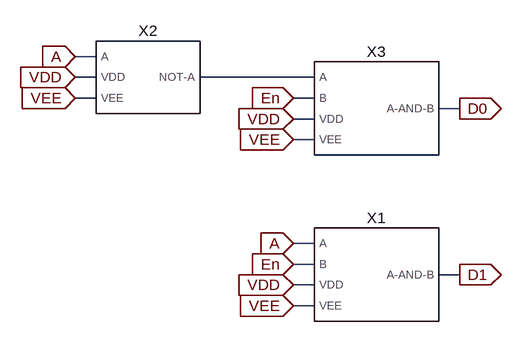
[diagram p0: schematic 1_to_2_Decoder_Symbol.asc]
1_to_2_Decoder_Symbol.asc, the LTspice schematic file:
Version 4
SHEET 1 880 680
WIRE 176 -48 144 -48
WIRE 176 -16 144 -16
WIRE 512 -16 336 -16
WIRE 176 16 144 16
WIRE 512 16 480 16
WIRE 736 32 704 32
WIRE 512 48 480 48
WIRE 512 80 480 80
WIRE 512 240 480 240
WIRE 512 272 480 272
WIRE 736 288 704 288
WIRE 512 304 480 304
WIRE 512 336 480 336
FLAG 144 -16 VDD
IOPIN 144 -16 In
FLAG 480 48 VDD
IOPIN 480 48 In
FLAG 480 304 VDD
IOPIN 480 304 In
FLAG 480 16 En
IOPIN 480 16 In
FLAG 480 80 VEE
IOPIN 480 80 In
FLAG 480 336 VEE
IOPIN 480 336 In
FLAG 480 272 En
IOPIN 480 272 In
FLAG 144 16 VEE
IOPIN 144 16 In
FLAG 144 -48 A
IOPIN 144 -48 In
FLAG 480 240 A
IOPIN 480 240 In
FLAG 736 32 D0
IOPIN 736 32 Out
FLAG 736 288 D1
IOPIN 736 288 Out
SYMBOL 2_Input_AND_Gate_Symbol 608 288 R0
SYMATTR InstName X1
SYMBOL Inverter_Gate_Symbol 256 -16 R0
SYMATTR InstName X2
SYMBOL 2_Input_AND_Gate_Symbol 608 32 R0
SYMATTR InstName X3

The netlist it stands for:
* 1_to_2_Decoder_Symbol.asc
XX1 A En VDD VEE D1 2_Input_AND_Gate_Symbol  ; pins A B VDD VEE A-AND-B
XX2 A VDD VEE N001 Inverter_Gate_Symbol  ; pins A VDD VEE NOT-A
XX3 N001 En VDD VEE D0 2_Input_AND_Gate_Symbol  ; pins A B VDD VEE A-AND-B
.backanno
.end